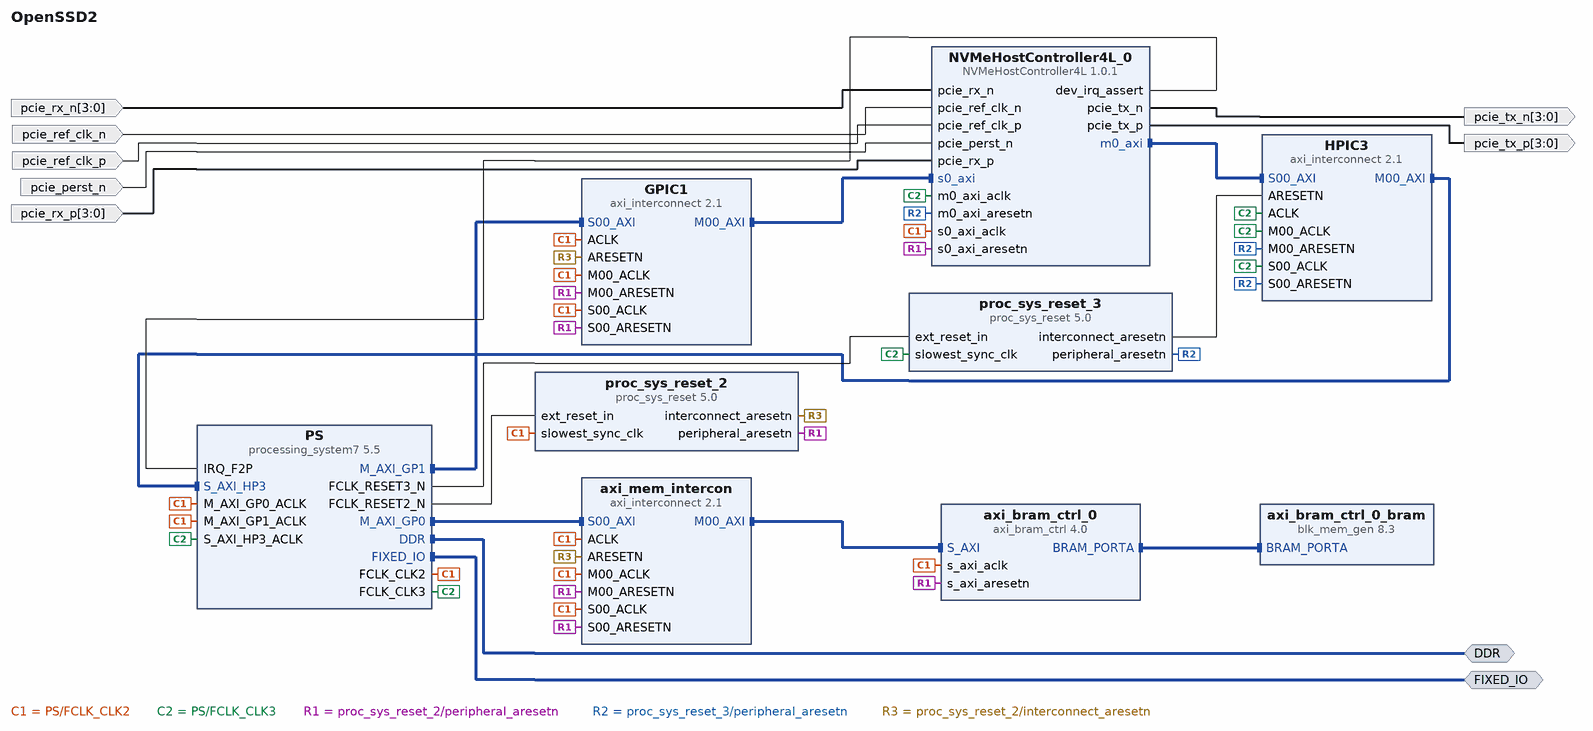
[diagram p0: block diagram of the top level]
# Vivado block design OpenSSD2, Vivado 2015.4.2
create_bd_design OpenSSD2

create_bd_intf_port -mode Master -vlnv xilinx.com:interface:ddrx_rtl:1.0 DDR
create_bd_intf_port -mode Master -vlnv xilinx.com:display_processing_system7:fixedio_rtl:1.0 FIXED_IO
create_bd_port -dir I -from 3 -to 0 -type data pcie_rx_n
create_bd_port -dir O -from 3 -to 0 -type data pcie_tx_n
create_bd_port -dir I pcie_ref_clk_n
create_bd_port -dir I pcie_ref_clk_p
create_bd_port -dir I pcie_perst_n
create_bd_port -dir O -from 3 -to 0 -type data pcie_tx_p
create_bd_port -dir I -from 3 -to 0 -type data pcie_rx_p

create_bd_cell -type ip -vlnv xilinx.com:ip:axi_interconnect:2.1 HPIC3
set_property -dict {CONFIG.NUM_MI 1} [get_bd_cells HPIC3]
create_bd_cell -type ip -vlnv xilinx.com:ip:axi_interconnect:2.1 GPIC1
set_property -dict {CONFIG.NUM_MI 1} [get_bd_cells GPIC1]
create_bd_cell -type ip -vlnv xilinx.com:ip:proc_sys_reset:5.0 proc_sys_reset_2
create_bd_cell -type ip -vlnv xilinx.com:ip:proc_sys_reset:5.0 proc_sys_reset_3
create_bd_cell -type ip -vlnv xilinx.com:ip:processing_system7:5.5 PS
set_property -dict [list \
  CONFIG.PCW_APU_PERIPHERAL_FREQMHZ 1000 \
  CONFIG.PCW_SDIO_PERIPHERAL_FREQMHZ 50 \
  CONFIG.PCW_FPGA0_PERIPHERAL_FREQMHZ 100 \
  CONFIG.PCW_FPGA1_PERIPHERAL_FREQMHZ 100 \
  CONFIG.PCW_FPGA2_PERIPHERAL_FREQMHZ 200 \
  CONFIG.PCW_FPGA3_PERIPHERAL_FREQMHZ 250 \
  CONFIG.PCW_USE_M_AXI_GP1 1 \
  CONFIG.PCW_USE_S_AXI_HP3 1 \
  CONFIG.PCW_USE_FABRIC_INTERRUPT 1 \
  CONFIG.PCW_EN_CLK0_PORT 0 \
  CONFIG.PCW_EN_CLK2_PORT 1 \
  CONFIG.PCW_EN_CLK3_PORT 1 \
  CONFIG.PCW_EN_RST0_PORT 0 \
  CONFIG.PCW_EN_RST2_PORT 1 \
  CONFIG.PCW_EN_RST3_PORT 1 \
  CONFIG.PCW_IRQ_F2P_INTR 1 \
  CONFIG.PCW_PRESET_BANK0_VOLTAGE {LVCMOS 1.8V} \
  CONFIG.PCW_PRESET_BANK1_VOLTAGE {LVCMOS 1.8V} \
  CONFIG.PCW_UIPARAM_DDR_PARTNO Custom \
  CONFIG.PCW_QSPI_PERIPHERAL_ENABLE 1 \
  CONFIG.PCW_QSPI_GRP_SINGLE_SS_ENABLE 0 \
  CONFIG.PCW_QSPI_GRP_IO1_ENABLE 1 \
  CONFIG.PCW_QSPI_GRP_FBCLK_ENABLE 1 \
  CONFIG.PCW_ENET0_PERIPHERAL_ENABLE 1 \
  CONFIG.PCW_ENET0_ENET0_IO {MIO 16 .. 27} \
  CONFIG.PCW_ENET0_GRP_MDIO_ENABLE 1 \
  CONFIG.PCW_ENET0_RESET_ENABLE 1 \
  CONFIG.PCW_ENET0_RESET_IO {MIO 47} \
  CONFIG.PCW_SD0_PERIPHERAL_ENABLE 1 \
  CONFIG.PCW_SD0_GRP_CD_ENABLE 1 \
  CONFIG.PCW_SD0_GRP_CD_IO {MIO 14} \
  CONFIG.PCW_SD0_GRP_WP_ENABLE 1 \
  CONFIG.PCW_SD0_GRP_WP_IO {MIO 15} \
  CONFIG.PCW_UART1_PERIPHERAL_ENABLE 1 \
  CONFIG.PCW_USB0_PERIPHERAL_ENABLE 1 \
  CONFIG.PCW_USB0_RESET_ENABLE 1 \
  CONFIG.PCW_USB0_RESET_IO {MIO 7} \
  CONFIG.PCW_I2C0_PERIPHERAL_ENABLE 1 \
  CONFIG.PCW_I2C0_I2C0_IO {MIO 50 .. 51} \
  CONFIG.PCW_I2C0_RESET_ENABLE 1 \
  CONFIG.PCW_I2C0_RESET_IO {MIO 46} \
  CONFIG.PCW_GPIO_MIO_GPIO_ENABLE 1 \
  CONFIG.PCW_ENET0_PERIPHERAL_FREQMHZ {100 Mbps} \
] [get_bd_cells PS]
# 82 more settings of PS are not shown: defaults, MIO pin electricals, DDR timing, and values the tool derives
create_bd_cell -type ip -vlnv xilinx.com:ip:axi_bram_ctrl:4.0 axi_bram_ctrl_0
set_property -dict {CONFIG.SINGLE_PORT_BRAM 1} [get_bd_cells axi_bram_ctrl_0]
create_bd_cell -type ip -vlnv xilinx.com:ip:blk_mem_gen:8.3 axi_bram_ctrl_0_bram
create_bd_cell -type ip -vlnv xilinx.com:ip:axi_interconnect:2.1 axi_mem_intercon
set_property -dict {CONFIG.NUM_MI 1} [get_bd_cells axi_mem_intercon]
create_bd_cell -type ip -vlnv ENCLab:ip:NVMeHostController4L:1.0.1 NVMeHostController4L_0

# ---- connections ----

connect_bd_intf_net [get_bd_intf_pins HPIC3/M00_AXI] [get_bd_intf_pins PS/S_AXI_HP3]
connect_bd_intf_net [get_bd_intf_pins GPIC1/S00_AXI] [get_bd_intf_pins PS/M_AXI_GP1]
connect_bd_intf_net [get_bd_intf_pins axi_bram_ctrl_0_bram/BRAM_PORTA] [get_bd_intf_pins axi_bram_ctrl_0/BRAM_PORTA]
connect_bd_intf_net [get_bd_intf_pins PS/M_AXI_GP0] [get_bd_intf_pins axi_mem_intercon/S00_AXI]
connect_bd_intf_net [get_bd_intf_pins axi_mem_intercon/M00_AXI] [get_bd_intf_pins axi_bram_ctrl_0/S_AXI]
connect_bd_intf_net [get_bd_intf_pins NVMeHostController4L_0/m0_axi] [get_bd_intf_pins HPIC3/S00_AXI]
connect_bd_intf_net [get_bd_intf_pins NVMeHostController4L_0/s0_axi] [get_bd_intf_pins GPIC1/M00_AXI]
connect_bd_intf_net -intf_net processing_system7_0_DDR [get_bd_intf_ports DDR] [get_bd_intf_pins PS/DDR]
connect_bd_intf_net -intf_net processing_system7_0_FIXED_IO [get_bd_intf_ports FIXED_IO] [get_bd_intf_pins PS/FIXED_IO]
connect_bd_net [get_bd_pins PS/FCLK_CLK2] \
  [get_bd_pins proc_sys_reset_2/slowest_sync_clk] [get_bd_pins PS/M_AXI_GP1_ACLK] [get_bd_pins PS/M_AXI_GP0_ACLK] \
  [get_bd_pins axi_bram_ctrl_0/s_axi_aclk] [get_bd_pins GPIC1/ACLK] [get_bd_pins GPIC1/S00_ACLK] [get_bd_pins GPIC1/M00_ACLK] \
  [get_bd_pins axi_mem_intercon/S00_ACLK] [get_bd_pins axi_mem_intercon/ACLK] [get_bd_pins axi_mem_intercon/M00_ACLK] \
  [get_bd_pins NVMeHostController4L_0/s0_axi_aclk]
connect_bd_net [get_bd_pins PS/FCLK_RESET2_N] [get_bd_pins proc_sys_reset_2/ext_reset_in]
connect_bd_net [get_bd_pins PS/FCLK_RESET3_N] [get_bd_pins proc_sys_reset_3/ext_reset_in]
connect_bd_net [get_bd_pins PS/FCLK_CLK3] \
  [get_bd_pins proc_sys_reset_3/slowest_sync_clk] [get_bd_pins PS/S_AXI_HP3_ACLK] [get_bd_pins HPIC3/ACLK] \
  [get_bd_pins HPIC3/S00_ACLK] [get_bd_pins HPIC3/M00_ACLK] [get_bd_pins NVMeHostController4L_0/m0_axi_aclk]
connect_bd_net [get_bd_pins proc_sys_reset_2/peripheral_aresetn] \
  [get_bd_pins axi_bram_ctrl_0/s_axi_aresetn] [get_bd_pins GPIC1/S00_ARESETN] [get_bd_pins GPIC1/M00_ARESETN] \
  [get_bd_pins axi_mem_intercon/S00_ARESETN] [get_bd_pins axi_mem_intercon/M00_ARESETN] \
  [get_bd_pins NVMeHostController4L_0/s0_axi_aresetn]
connect_bd_net -net ARESETN_2 [get_bd_pins proc_sys_reset_3/interconnect_aresetn] [get_bd_pins HPIC3/ARESETN]
connect_bd_net -net M00_ARESETN_2 [get_bd_pins proc_sys_reset_3/peripheral_aresetn] \
  [get_bd_pins HPIC3/S00_ARESETN] [get_bd_pins HPIC3/M00_ARESETN] [get_bd_pins NVMeHostController4L_0/m0_axi_aresetn]
connect_bd_net -net ARESETN_3 [get_bd_pins proc_sys_reset_2/interconnect_aresetn] [get_bd_pins GPIC1/ARESETN] [get_bd_pins axi_mem_intercon/ARESETN]
connect_bd_net [get_bd_ports pcie_rx_n] [get_bd_pins NVMeHostController4L_0/pcie_rx_n]
connect_bd_net [get_bd_ports pcie_ref_clk_n] [get_bd_pins NVMeHostController4L_0/pcie_ref_clk_n]
connect_bd_net [get_bd_ports pcie_ref_clk_p] [get_bd_pins NVMeHostController4L_0/pcie_ref_clk_p]
connect_bd_net [get_bd_ports pcie_perst_n] [get_bd_pins NVMeHostController4L_0/pcie_perst_n]
connect_bd_net [get_bd_ports pcie_rx_p] [get_bd_pins NVMeHostController4L_0/pcie_rx_p]
connect_bd_net [get_bd_pins NVMeHostController4L_0/pcie_tx_p] [get_bd_ports pcie_tx_p]
connect_bd_net [get_bd_pins NVMeHostController4L_0/pcie_tx_n] [get_bd_ports pcie_tx_n]
connect_bd_net [get_bd_pins NVMeHostController4L_0/dev_irq_assert] [get_bd_pins PS/IRQ_F2P]

# ---- address map ----
assign_bd_address -offset 0x00000000 -range 1G -target_address_space [get_bd_addr_spaces NVMeHostController4L_0/m0_axi] [get_bd_addr_segs PS/S_AXI_HP3/HP3_DDR_LOWOCM]
assign_bd_address -offset 0x40000000 -range 8K -target_address_space [get_bd_addr_spaces PS/Data] [get_bd_addr_segs axi_bram_ctrl_0/S_AXI/Mem0]
assign_bd_address -offset 0x83C00000 -range 64K -target_address_space [get_bd_addr_spaces PS/Data] [get_bd_addr_segs NVMeHostController4L_0/s0_axi/reg0]

validate_bd_design
save_bd_design
